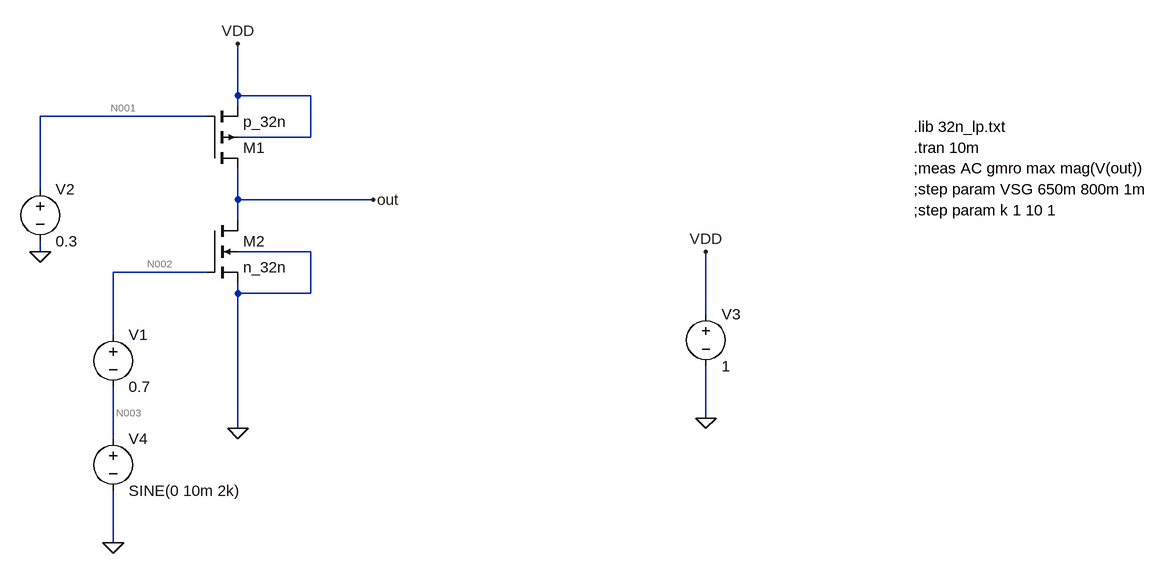
[diagram p0: schematic 32nm_cs_activeLoad.asc]
32nm_cs_activeLoad.asc, the LTspice schematic file:
Version 4
SHEET 1 880 680
WIRE -576 -32 -576 -112
WIRE -464 -32 -576 -32
WIRE -576 -16 -576 -32
WIRE -624 0 -880 0
WIRE -464 32 -464 -32
WIRE -464 32 -576 32
WIRE -880 112 -880 0
WIRE -576 128 -576 80
WIRE -368 128 -576 128
WIRE -576 160 -576 128
WIRE -880 208 -880 192
WIRE -464 208 -576 208
WIRE -624 240 -768 240
WIRE -576 272 -576 256
WIRE -464 272 -464 208
WIRE -464 272 -576 272
WIRE 144 304 144 208
WIRE -768 336 -768 240
WIRE 144 464 144 384
WIRE -576 480 -576 272
WIRE -768 496 -768 416
WIRE -768 656 -768 576
FLAG -880 208 0
FLAG -576 -112 VDD
FLAG -576 480 0
FLAG -368 128 out
FLAG 144 464 0
FLAG 144 208 VDD
FLAG -768 656 0
SYMBOL voltage -880 96 R0
WINDOW 123 0 0 Left 0
WINDOW 39 0 0 Left 0
SYMATTR InstName V2
SYMATTR Value 0.3
SYMBOL pmos4 -624 80 M180
SYMATTR InstName M1
SYMATTR Value p_32n
SYMATTR Value2 l=128n w=10.4u
SYMBOL nmos4 -624 160 R0
SYMATTR InstName M2
SYMATTR Value n_32n
SYMATTR Value2 l=96n w=3.84u
SYMBOL voltage -768 320 R0
WINDOW 123 0 0 Left 0
WINDOW 39 0 0 Left 0
SYMATTR InstName V1
SYMATTR Value 0.7
SYMBOL voltage 144 288 R0
WINDOW 123 0 0 Left 0
WINDOW 39 0 0 Left 0
SYMATTR InstName V3
SYMATTR Value 1
SYMBOL voltage -768 480 R0
WINDOW 123 0 0 Left 0
WINDOW 39 0 0 Left 0
SYMATTR InstName V4
SYMATTR Value SINE(0 10m 2k)
TEXT 464 16 Left 2 !.lib 32n_lp.txt
TEXT 464 48 Left 2 !.tran 10m
TEXT 464 80 Left 2 !;meas AC gmro max mag(V(out))
TEXT 464 112 Left 2 !;step param VSG 650m 800m 1m
TEXT 464 144 Left 2 !;step param k 1 10 1

The netlist it stands for:
* 32nm_cs_activeLoad.asc
V2 N001 0 0.3
M1 out N001 VDD VDD p_32n l=128n w=10.4u
M2 out N002 0 0 n_32n l=96n w=3.84u
V1 N002 N003 0.7
V3 VDD 0 1
V4 N003 0 SINE(0 10m 2k)
.model NMOS NMOS
.model PMOS PMOS
.lib standard.mos
.lib 32n_lp.txt
.tran 10m
;meas AC gmro max mag(V(out))
;step param VSG 650m 800m 1m
;step param k 1 10 1
.backanno
.end

* Results of the author's LTspice run, read from the files saved beside the schematic
* Operating Point, zero values left out:
*   V(n001) = 300 mV
*   V(out) = 508.2 mV
*   V(vdd) = 1 V
*   V(n002) = 700 mV
*   Id(M2) = 75.8 µA
*   Ig(M2) = 199.3 pA
*   Is(M2) = -75.8 µA
*   Id(M1) = -75.8 µA
*   Ig(M1) = -471.5 pA
*   Is(M1) = 75.8 µA
*   I(V4) = -199.3 pA
*   I(V3) = -75.8 µA
*   I(V1) = -199.3 pA
*   I(V2) = 471.5 pA
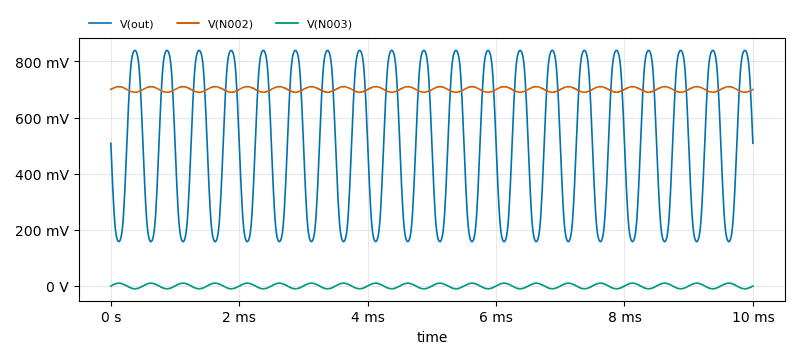
[diagram p1: Transient Analysis of 32nm_cs_activeLoad.asc, plotted from the saved traces]
* Transient Analysis, 1 run:
*   V(out): min 157.9 mV, max 839.2 mV, average 503.3 mV, rms 567.3 mV, last 508.2 mV
*   V(N002): min 690 mV, max 710 mV, average 700 mV, rms 700 mV, last 700 mV
*   V(N003): min -10 mV, max 10 mV, average -49.16 nV, rms 7.094 mV, last 0 V